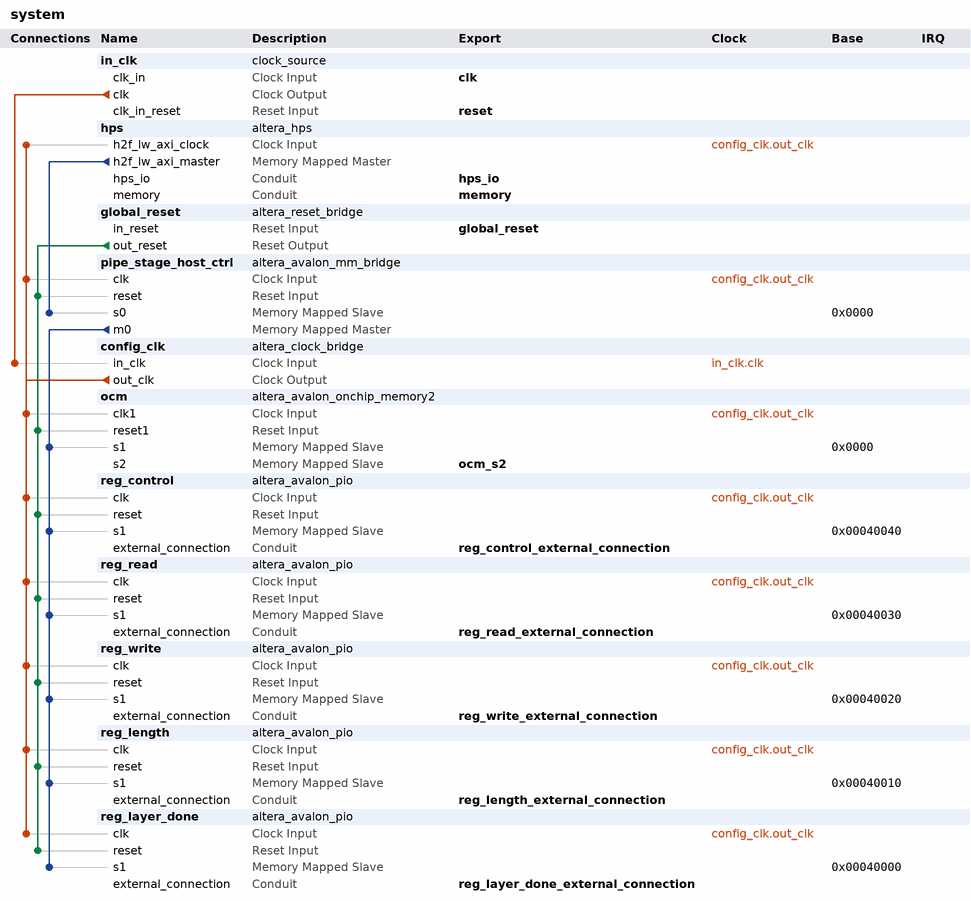
[diagram p0: system contents]
# Platform Designer (Qsys) system system, Cyclone V 5CSXFC6D6F31C6
# Parameters at their usual value, and those the tool derives, are not listed.
package require -exact qsys 25.1
create_system system
set_project_property DEVICE_FAMILY {Cyclone V}
set_project_property DEVICE 5CSXFC6D6F31C6

add_instance in_clk clock_source 25.1
set_instance_parameter_value in_clk clockFrequency 50000000
set_instance_parameter_value in_clk resetSynchronousEdges DEASSERT

add_instance hps altera_hps 25.1
set_instance_parameter_value hps EMAC1_Mode RGMII
set_instance_parameter_value hps EMAC1_PinMuxing {HPS I/O Set 0}
set_instance_parameter_value hps F2SCLK_COLDRST_Enable false
set_instance_parameter_value hps F2SCLK_DBGRST_Enable false
set_instance_parameter_value hps F2SCLK_WARMRST_Enable false
set_instance_parameter_value hps F2SINTERRUPT_Enable true
set_instance_parameter_value hps F2S_Width 0
set_instance_parameter_value hps FPGA_PERIPHERAL_OUTPUT_CLOCK_FREQ_EMAC0_GTX_CLK 125
set_instance_parameter_value hps FPGA_PERIPHERAL_OUTPUT_CLOCK_FREQ_EMAC0_MD_CLK 2.5
set_instance_parameter_value hps FPGA_PERIPHERAL_OUTPUT_CLOCK_FREQ_EMAC1_GTX_CLK 125
set_instance_parameter_value hps FPGA_PERIPHERAL_OUTPUT_CLOCK_FREQ_EMAC1_MD_CLK 2.5
set_instance_parameter_value hps HPS_PROTOCOL DDR3
set_instance_parameter_value hps I2C0_Mode N/A
set_instance_parameter_value hps I2C0_PinMuxing Unused
set_instance_parameter_value hps I2C1_Mode I2C
set_instance_parameter_value hps I2C1_PinMuxing {HPS I/O Set 0}
set_instance_parameter_value hps LWH2F_Enable true
set_instance_parameter_value hps MEM_BANKADDR_WIDTH 3
set_instance_parameter_value hps MEM_CLK_FREQ 400.0
set_instance_parameter_value hps MEM_CLK_FREQ_MAX 400.0
set_instance_parameter_value hps MEM_COL_ADDR_WIDTH 8
set_instance_parameter_value hps MEM_DQ_WIDTH 8
set_instance_parameter_value hps MEM_DRV_STR RZQ/6
set_instance_parameter_value hps MEM_ROW_ADDR_WIDTH 12
set_instance_parameter_value hps MEM_RTT_NOM {ODT Disabled}
set_instance_parameter_value hps MEM_RTT_WR {Dynamic ODT off}
set_instance_parameter_value hps MEM_TCL 7
set_instance_parameter_value hps MEM_TFAW_NS 37.5
set_instance_parameter_value hps MEM_TINIT_US 499
set_instance_parameter_value hps MEM_TMRD_CK 3
set_instance_parameter_value hps MEM_TRAS_NS 40.0
set_instance_parameter_value hps MEM_TRCD_NS 15.0
set_instance_parameter_value hps MEM_TREFI_US 7.0
set_instance_parameter_value hps MEM_TRFC_NS 75.0
set_instance_parameter_value hps MEM_TRP_NS 15.0
set_instance_parameter_value hps MEM_TWTR 2
set_instance_parameter_value hps MEM_VENDOR JEDEC
set_instance_parameter_value hps MEM_WTCL 6
set_instance_parameter_value hps QSPI_Mode N/A
set_instance_parameter_value hps QSPI_PinMuxing Unused
set_instance_parameter_value hps REF_CLK_FREQ 25.0
set_instance_parameter_value hps S2FCLK_USER2CLK 5
set_instance_parameter_value hps S2F_Width 0
set_instance_parameter_value hps SDIO_Mode {4-bit Data}
set_instance_parameter_value hps SDIO_PinMuxing {HPS I/O Set 0}
set_instance_parameter_value hps SPIM1_Mode N/A
set_instance_parameter_value hps SPIM1_PinMuxing Unused
set_instance_parameter_value hps STM_Enable false
set_instance_parameter_value hps TIMING_BOARD_AC_SKEW 0.02
set_instance_parameter_value hps TIMING_BOARD_AC_TO_CK_SKEW 0.0
set_instance_parameter_value hps TIMING_BOARD_DQ_TO_DQS_SKEW 0.0
set_instance_parameter_value hps TIMING_BOARD_MAX_CK_DELAY 0.6
set_instance_parameter_value hps TIMING_BOARD_MAX_DQS_DELAY 0.6
set_instance_parameter_value hps TIMING_BOARD_SKEW_BETWEEN_DQS 0.02
set_instance_parameter_value hps TIMING_BOARD_SKEW_CKDQS_DIMM_MAX 0.01
set_instance_parameter_value hps TIMING_BOARD_SKEW_CKDQS_DIMM_MIN -0.01
set_instance_parameter_value hps TIMING_BOARD_SKEW_WITHIN_DQS 0.02
set_instance_parameter_value hps TIMING_TDH 125
set_instance_parameter_value hps TIMING_TDQSCK 400
set_instance_parameter_value hps TIMING_TDQSQ 120
set_instance_parameter_value hps TIMING_TDS 50
set_instance_parameter_value hps TIMING_TIH 250
set_instance_parameter_value hps TIMING_TIS 175
set_instance_parameter_value hps TIMING_TQSH 0.38
set_instance_parameter_value hps UART0_Mode {No Flow Control}
set_instance_parameter_value hps UART0_PinMuxing {HPS I/O Set 0}
set_instance_parameter_value hps USB1_Mode SDR
set_instance_parameter_value hps USB1_PinMuxing {HPS I/O Set 0}
set_instance_parameter_value hps desired_cfg_clk_mhz 100.0
set_instance_parameter_value hps desired_qspi_clk_mhz 400.0

add_instance global_reset altera_reset_bridge 25.1
set_instance_parameter_value global_reset ACTIVE_LOW_RESET 1
set_instance_parameter_value global_reset SYNCHRONOUS_EDGES none

add_instance pipe_stage_host_ctrl altera_avalon_mm_bridge 25.1
set_instance_parameter_value pipe_stage_host_ctrl ADDRESS_UNITS SYMBOLS
set_instance_parameter_value pipe_stage_host_ctrl ADDRESS_WIDTH 10
set_instance_parameter_value pipe_stage_host_ctrl DATA_WIDTH 32
set_instance_parameter_value pipe_stage_host_ctrl MAX_PENDING_RESPONSES 4
set_instance_parameter_value pipe_stage_host_ctrl USE_AUTO_ADDRESS_WIDTH 1

add_instance config_clk altera_clock_bridge 25.1
set_instance_parameter_value config_clk DERIVED_CLOCK_RATE 50000000
set_instance_parameter_value config_clk EXPLICIT_CLOCK_RATE 50000000

add_instance ocm altera_avalon_onchip_memory2 25.1
set_instance_parameter_value ocm dataWidth 32
set_instance_parameter_value ocm dualPort true
set_instance_parameter_value ocm initMemContent true
set_instance_parameter_value ocm initializationFileName onchip_mem.hex
set_instance_parameter_value ocm memorySize 262144
set_instance_parameter_value ocm singleClockOperation true

add_instance reg_control altera_avalon_pio 25.1
set_instance_parameter_value reg_control direction Output
set_instance_parameter_value reg_control width 32

add_instance reg_read altera_avalon_pio 25.1
set_instance_parameter_value reg_read direction Output
set_instance_parameter_value reg_read width 32

add_instance reg_write altera_avalon_pio 25.1
set_instance_parameter_value reg_write direction Output
set_instance_parameter_value reg_write width 32

add_instance reg_length altera_avalon_pio 25.1
set_instance_parameter_value reg_length direction Output
set_instance_parameter_value reg_length width 32

add_instance reg_layer_done altera_avalon_pio 25.1
set_instance_parameter_value reg_layer_done direction Input
set_instance_parameter_value reg_layer_done width 1

# connections
add_connection config_clk.out_clk hps.h2f_lw_axi_clock clock
add_connection config_clk.out_clk ocm.clk1 clock
add_connection config_clk.out_clk pipe_stage_host_ctrl.clk clock
add_connection config_clk.out_clk reg_control.clk clock
add_connection config_clk.out_clk reg_layer_done.clk clock
add_connection config_clk.out_clk reg_length.clk clock
add_connection config_clk.out_clk reg_read.clk clock
add_connection config_clk.out_clk reg_write.clk clock
add_connection in_clk.clk config_clk.in_clk clock
add_connection global_reset.out_reset ocm.reset1 reset
add_connection global_reset.out_reset pipe_stage_host_ctrl.reset reset
add_connection global_reset.out_reset reg_control.reset reset
add_connection global_reset.out_reset reg_layer_done.reset reset
add_connection global_reset.out_reset reg_length.reset reset
add_connection global_reset.out_reset reg_read.reset reset
add_connection global_reset.out_reset reg_write.reset reset
add_connection hps.h2f_lw_axi_master pipe_stage_host_ctrl.s0 avalon
set_connection_parameter_value hps.h2f_lw_axi_master/pipe_stage_host_ctrl.s0 baseAddress 0x0000
add_connection pipe_stage_host_ctrl.m0 ocm.s1 avalon
set_connection_parameter_value pipe_stage_host_ctrl.m0/ocm.s1 baseAddress 0x0000
add_connection pipe_stage_host_ctrl.m0 reg_control.s1 avalon
set_connection_parameter_value pipe_stage_host_ctrl.m0/reg_control.s1 baseAddress 0x00040040
add_connection pipe_stage_host_ctrl.m0 reg_layer_done.s1 avalon
set_connection_parameter_value pipe_stage_host_ctrl.m0/reg_layer_done.s1 baseAddress 0x00040000
add_connection pipe_stage_host_ctrl.m0 reg_length.s1 avalon
set_connection_parameter_value pipe_stage_host_ctrl.m0/reg_length.s1 baseAddress 0x00040010
add_connection pipe_stage_host_ctrl.m0 reg_read.s1 avalon
set_connection_parameter_value pipe_stage_host_ctrl.m0/reg_read.s1 baseAddress 0x00040030
add_connection pipe_stage_host_ctrl.m0 reg_write.s1 avalon
set_connection_parameter_value pipe_stage_host_ctrl.m0/reg_write.s1 baseAddress 0x00040020

# exported interfaces
add_interface clk clock sink
set_interface_property clk EXPORT_OF in_clk.clk_in
add_interface global_reset reset sink
set_interface_property global_reset EXPORT_OF global_reset.in_reset
add_interface hps_io conduit end
set_interface_property hps_io EXPORT_OF hps.hps_io
add_interface memory conduit end
set_interface_property memory EXPORT_OF hps.memory
add_interface ocm_s2 avalon slave
set_interface_property ocm_s2 EXPORT_OF ocm.s2
add_interface reg_control_external_connection conduit end
set_interface_property reg_control_external_connection EXPORT_OF reg_control.external_connection
add_interface reg_layer_done_external_connection conduit end
set_interface_property reg_layer_done_external_connection EXPORT_OF reg_layer_done.external_connection
add_interface reg_length_external_connection conduit end
set_interface_property reg_length_external_connection EXPORT_OF reg_length.external_connection
add_interface reg_read_external_connection conduit end
set_interface_property reg_read_external_connection EXPORT_OF reg_read.external_connection
add_interface reg_write_external_connection conduit end
set_interface_property reg_write_external_connection EXPORT_OF reg_write.external_connection
add_interface reset reset sink
set_interface_property reset EXPORT_OF in_clk.clk_in_reset

set_interconnect_requirement {$system} qsys_mm.clockCrossingAdapter HANDSHAKE
set_interconnect_requirement {$system} qsys_mm.enableEccProtection FALSE
set_interconnect_requirement {$system} qsys_mm.insertDefaultSlave FALSE
set_interconnect_requirement {$system} qsys_mm.maxAdditionalLatency 1

save_system system.qsys
